# EAGLE design TwoArmedBandit_v1.1 (EAGLE 9.6.2)
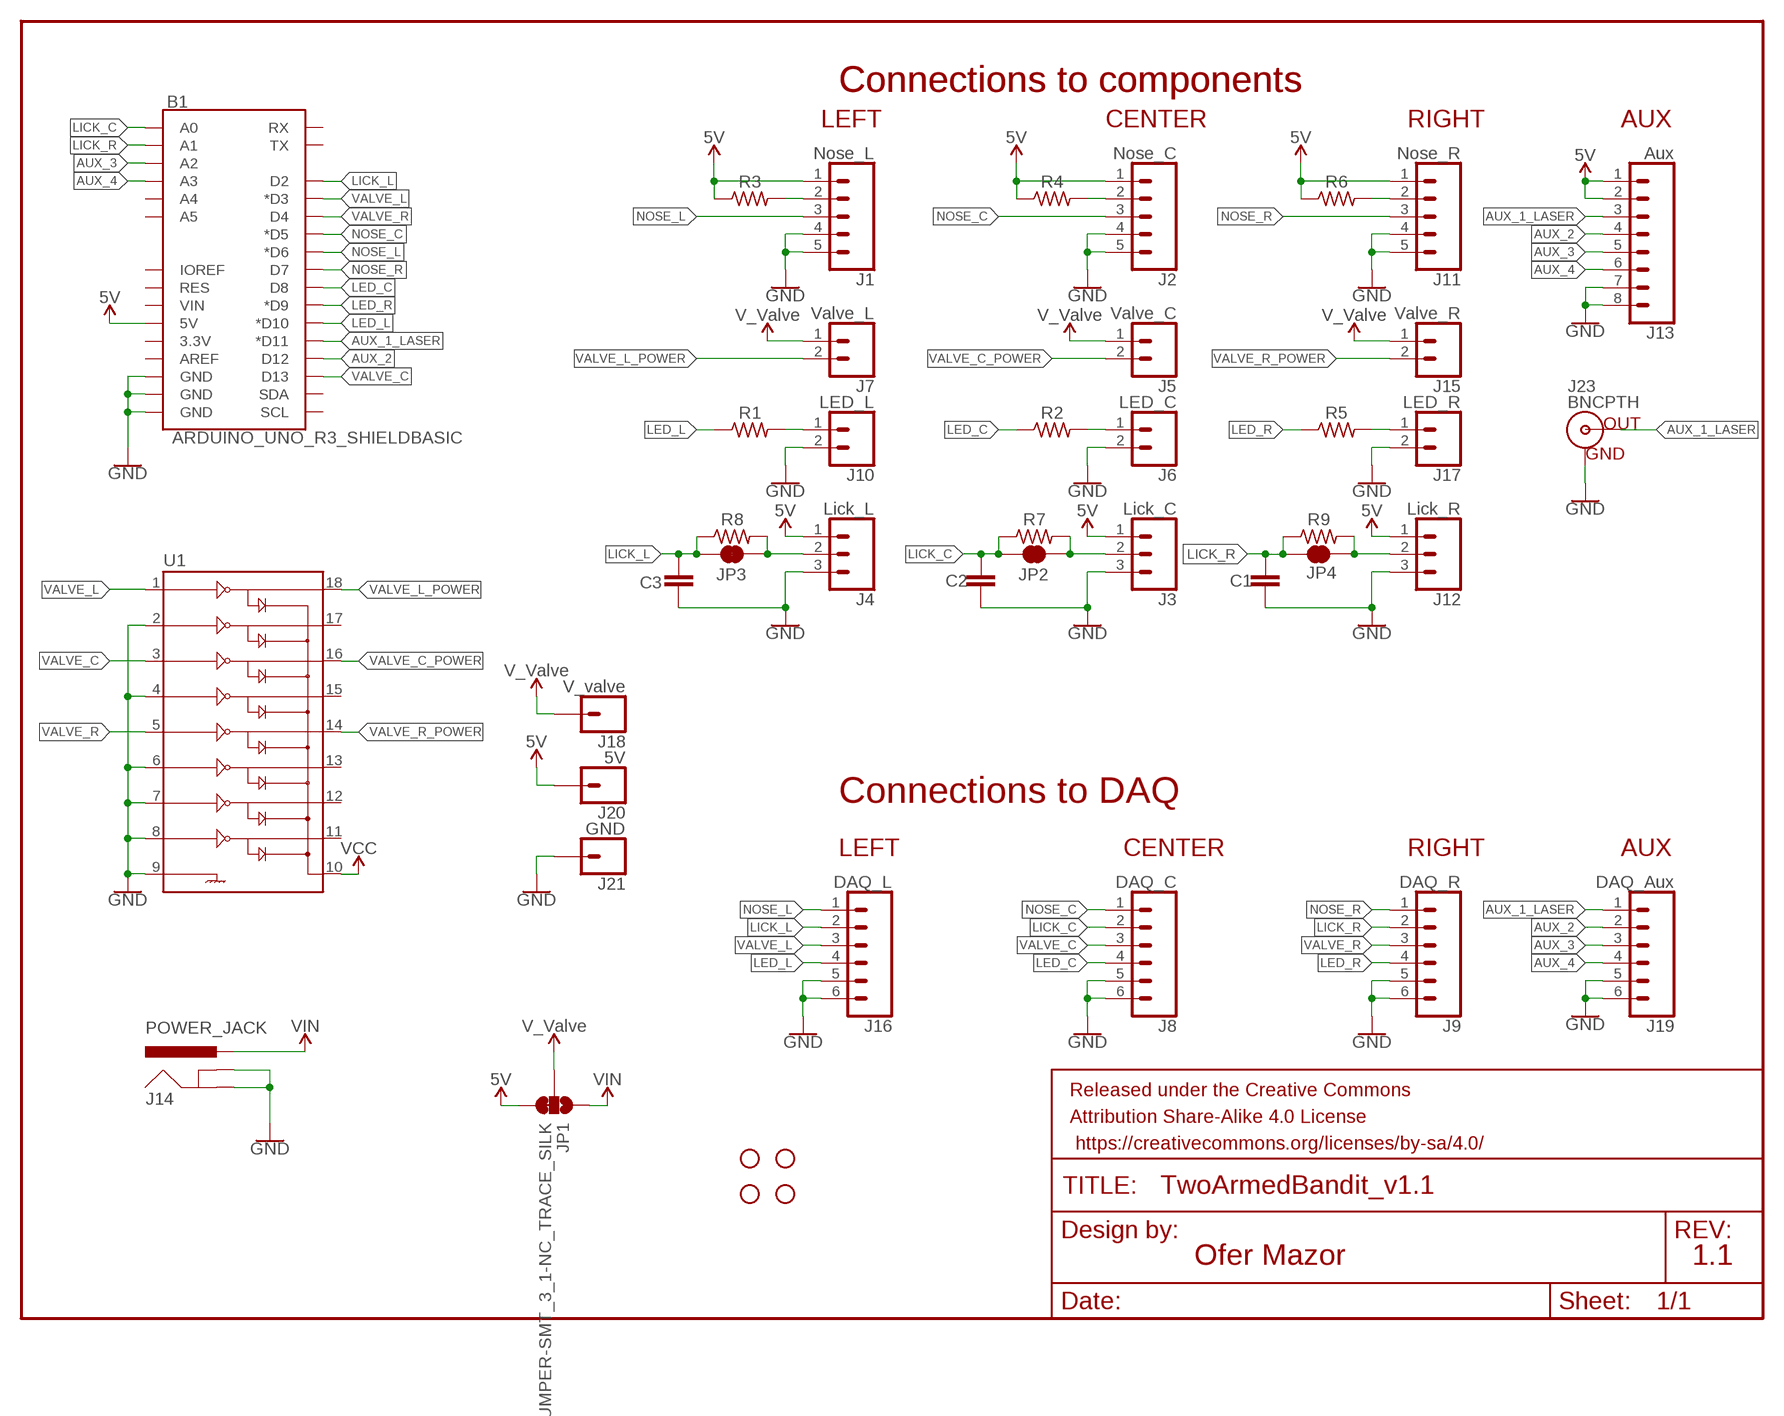
[diagram p0: schematic, sheet 1]

## Parts
B1  ARDUINO_UNO_R3_SHIELDBASIC  [UNO_R3_SHIELD]
C1  C5/2.5  [C5B2.5]
C2  C5/2.5  [C5B2.5]
C3  C5/2.5  [C5B2.5]
FRAME1  FRAME-LETTERNO_PACKAGE  [DUMMY]
H1  STAND-OFF  [STAND-OFF]
H2  STAND-OFF  [STAND-OFF]
H3  STAND-OFF  [STAND-OFF]
H4  STAND-OFF  [STAND-OFF]
J1  Nose_L  CONN_05SCREW  [SCREWTERMINAL-3.5MM-5]
J2  Nose_C  CONN_05SCREW  [SCREWTERMINAL-3.5MM-5]
J3  Lick_C  CONN_03  [1X03]
J4  Lick_L  CONN_03  [1X03]
J5  Valve_C  CONN_02  [1X02]
J6  LED_C  CONN_02  [1X02]
J7  Valve_L  CONN_02  [1X02]
J8  DAQ_C  CONN_063.5MM-6  [SCREWTERMINAL-3.5MM-6]
J9  DAQ_R  CONN_063.5MM-6  [SCREWTERMINAL-3.5MM-6]
J10  LED_L  CONN_02  [1X02]
J11  Nose_R  CONN_05SCREW  [SCREWTERMINAL-3.5MM-5]
J12  Lick_R  CONN_03  [1X03]
J13  Aux  CONN_08"  [1X08]
J14  POWER_JACK  [POWER_JACK_PTH]
J15  Valve_R  CONN_02  [1X02]
J16  DAQ_L  CONN_063.5MM-6  [SCREWTERMINAL-3.5MM-6]
J17  LED_R  CONN_02  [1X02]
J18  V_valve  CONN_01PTH_2MM  [1X01_2MM]
J19  DAQ_Aux  CONN_063.5MM-6  [SCREWTERMINAL-3.5MM-6]
J20  5V  CONN_01PTH_2MM  [1X01_2MM]
J21  GND  CONN_01PTH_2MM  [1X01_2MM]
J23  BNCPTH  [BNC]
JP1  JUMPER-SMT_3_1-NC_TRACE_SILK  [SMT-JUMPER_3_1-NC_TRACE_SILK]
JP2  JUMPER-SMT_2_NC_TRACE_NO-SILK  [SMT-JUMPER_2_NC_TRACE_NO-SILK]
JP3  JUMPER-SMT_2_NC_TRACE_NO-SILK  [SMT-JUMPER_2_NC_TRACE_NO-SILK]
JP4  JUMPER-SMT_2_NC_TRACE_NO-SILK  [SMT-JUMPER_2_NC_TRACE_NO-SILK]
R1  330  R-US_0309/12  [0309/12]
R2  330  R-US_0309/12  [0309/12]
R3  160  R-US_0309/12  [0309/12]
R4  160  R-US_0309/12  [0309/12]
R5  330  R-US_0309/12  [0309/12]
R6  160  R-US_0309/12  [0309/12]
R7  160  R-US_0309/12  [0309/12]
R8  160  R-US_0309/12  [0309/12]
R9  160  R-US_0309/12  [0309/12]
U1  ULN2803DIP  [DIL18]

## Nets
5V [power]: B1.5V J1.1 J2.1 J3.1 J4.1 J11.1 J12.1 J13.1 J13.2 J20.1 JP1.3 R3.1 R4.1 R6.1
AUX_1_LASER: B1.D11(*D11) J13.3 J19.1 J23.S(OUT)
AUX_2: B1.D12 J13.4 J19.2
AUX_3: B1.A2 J13.5 J19.3
AUX_4: B1.A3 J13.6 J19.4
GND [power]: B1.GND@0(GND) B1.GND@1(GND) B1.GND@2(GND) C1.2 C2.2 C3.2 J1.4 J1.5 J2.4 J2.5 J3.3 J4.3 J6.2 J8.5 J8.6 J9.5 J9.6 J10.2 J11.4 J11.5 J12.3 J13.7 J13.8 J14.GND J14.GNDBREAK J16.5 J16.6 J17.2 J19.5 J19.6 J21.1 J23.GND U1.2 U1.4 U1.6 U1.7 U1.8 U1.9
LED_C: B1.D8 J8.4 R2.1
LED_L: B1.D10(*D10) J16.4 R1.1
LED_R: B1.D9(*D9) J9.4 R5.1
LICK_C: B1.A0 C2.1 J8.2 JP2.1 R7.1
LICK_L: B1.D2 C3.1 J16.2 JP3.1 R8.1
LICK_R: B1.A1 C1.1 J9.2 JP4.1 R9.1
N$1: J2.2 R4.2
N$2: J1.2 R3.2
N$3: J6.1 R2.2
N$4: J11.2 R6.2
N$5: J17.1 R5.2
N$6: J12.2 JP4.2 R9.2
N$7: J3.2 JP2.2 R7.2
N$8: J4.2 JP3.2 R8.2
N$11: J10.1 R1.2
NOSE_C: B1.D5(*D5) J2.3 J8.1
NOSE_L: B1.D6(*D6) J1.3 J16.1
NOSE_R: B1.D7 J9.1 J11.3
V_VALVE [power]: J5.1 J7.1 J15.1 J18.1 JP1.2 U1.10 ; supply symbol labelled VCC, V_Valve
VALVE_C: B1.D13 J8.3 U1.3
VALVE_C_POWER [power]: J5.2 U1.16
VALVE_L: B1.D3(*D3) J16.3 U1.1
VALVE_L_POWER [power]: J7.2 U1.18
VALVE_R: B1.D4 J9.3 U1.5
VALVE_R_POWER [power]: J15.2 U1.14
VIN [power]: J14.PWR JP1.1
Unconnected: B1.3.3V B1.A4 B1.A5 B1.AREF B1.IOREF B1.RES B1.RX B1.SCL B1.SDA B1.TX B1.VIN U1.11 U1.12 U1.13 U1.15 U1.17

## Notes on the sheet
- Connections to components | Connections to components
- LEFT | CENTER | RIGHT | AUX
- Connections to DAQ
- LEFT | CENTER | RIGHT | AUX
- Ofer Mazor | 1.1

## Library data of the parts
B1 = SparkFun-Boards:ARDUINO_UNO_R3_SHIELD: Arduino R3 Shield Footprint Shield form compatible with the Arduino Uno R3. SparkFun Products: MG2639 Cellular Shield <https://www.sparkfun.com/products/13120> MIDI Shield <https://www.sparkfun.com/products/12898> R3 Stackable Headers Kit <https://www.sparkfun.com/products/11417>
C1-C3 = capacitor-wima:C: CAPACITOR naming: grid - package width
FRAME1 = SparkFun-Aesthetics:FRAME-LETTER: Schematic Frame - Letter Standard 8.5x11 US Letter frame; DESIGNER: Ofer Mazor; VERSION: v01.1
H1-H4 = SparkFun-Hardware:STAND-OFF: Stand Off Drill holes for mechanically mounting via screws, standoffs, etc. Note: Use the keepout ring to avoid running the screw head into surrounding components. Variant Overviews STAND-OFF - Mechanical footprint for a #4 phillips button head screw. STAND-OFF-TIGHT - Mechanical footprint for a #4 phillips button head screw, Example SparkFun Products Screw - Phillips Head (1/4", 4-40, 10 pack) <https://www.sparkfun.com/products/10453> (PRT-10453) Screw - Phillips Head (1/2", 4-40, 10 pack) <https://www.sparkfun.com/products/10452> (PRT-10452) Screw - Phillips Head (3/4", 4-40, 10 pack) <https://www.sparkfun.com/products/10451> (PRT-10451) Screw - Phillips Head (1", 4-40, 10 pack) <https://www.sparkfun.com/products/10450> (PRT-10450)
J1 J2 J11 = SparkFun-Connectors:CONN_05: Multi connection point. Often used as Generic Header-pin footprint for 0.1 inch spaced/style header connections On any of the 0.1 inch spaced packages, you can populate with these: Break Away Headers - Straight <https://www.sparkfun.com/products/116> (PRT-00116) Break Away Male Headers - Right Angle <https://www.sparkfun.com/products/553> (PRT-00553) Female Headers <https://www.sparkfun.com/products/115> (PRT-00115) Break Away Headers - Machine Pin <https://www.sparkfun.com/products/117> (PRT-00117) Break Away Female Headers - Swiss Machine Pin <https://www.sparkfun.com/products/743> (PRT-00743) For SCREWTERMINALS and SPRING TERMINALS visit here: Screw Terimnals on SparkFun.com <https://www.sparkfun.com/search/results?term=Screw+Terminals> (5mm/3.5mm/2.54mm spacing) This device is also useful as a general connection point to wire up your design to another part of your project. Our various solder wires solder well into these plated through hole pads. Hook-Up Wire - Assortment (Stranded, 22 AWG) <https://www.sparkfun.com/products/11375> (PRT-11375) Hook-Up Wire - Assortment (Solid Core, 22 AWG) <https://www.sparkfun.com/products/11367> (PRT-11367) View the entire wire category on our website here <https://www.sparkfun.com/categories/141> Special notes: Molex polarized connector foot print use with SKU : PRT-08231 with associated crimp pins and housings. 1MM SMD Version SKU: PRT-10208; PROD_ID: Combine 8288+8399
J3 J4 J12 = SparkFun-Connectors:CONN_03: Multi connection point. Often used as Generic Header-pin footprint for 0.1 inch spaced/style header connections On any of the 0.1 inch spaced packages, you can populate with these: Break Away Headers - Straight <https://www.sparkfun.com/products/116> (PRT-00116) Break Away Male Headers - Right Angle <https://www.sparkfun.com/products/553> (PRT-00553) Female Headers <https://www.sparkfun.com/products/115> (PRT-00115) Break Away Headers - Machine Pin <https://www.sparkfun.com/products/117> (PRT-00117) Break Away Female Headers - Swiss Machine Pin <https://www.sparkfun.com/products/743> (PRT-00743) Stackable Header - 3 Pin (Female, 0.1") <https://www.sparkfun.com/products/13875> (PRT-13875) For SCREWTERMINALS and SPRING TERMINALS visit here: Screw Terimnals on SparkFun.com <https://www.sparkfun.com/search/results?term=Screw+Terminals> (5mm/3.5mm/2.54mm spacing) This device is also useful as a general connection point to wire up your design to another part of your project. Our various solder wires solder well into these plated through hole pads. Hook-Up Wire - Assortment (Stranded, 22 AWG) <https://www.sparkfun.com/products/11375> (PRT-11375) Hook-Up Wire - Assortment (Solid Core, 22 AWG) <https://www.sparkfun.com/products/11367> (PRT-11367) View the entire wire category on our website here <https://www.sparkfun.com/categories/141> Special notes: Molex polarized connector foot print use with SKU : PRT-08232 with associated crimp pins and housings.
J5-J7 J10 J15 J17 = SparkFun-Connectors:CONN_02: Multi connection point. Often used as Generic Header-pin footprint for 0.1 inch spaced/style header connections On any of the 0.1 inch spaced packages, you can populate with these: Break Away Headers - Straight <https://www.sparkfun.com/products/116> (PRT-00116) Break Away Male Headers - Right Angle <https://www.sparkfun.com/products/553> (PRT-00553) Female Headers <https://www.sparkfun.com/products/115> (PRT-00115) Break Away Headers - Machine Pin <https://www.sparkfun.com/products/117> (PRT-00117) Break Away Female Headers - Swiss Machine Pin <https://www.sparkfun.com/products/743> (PRT-00743) For SCREWTERMINALS and SPRING TERMINALS visit here: Screw Terimnals on SparkFun.com <https://www.sparkfun.com/search/results?term=Screw+Terminals> (5mm/3.5mm/2.54mm spacing) This device is also useful as a general connection point to wire up your design to another part of your project. Our various solder wires solder well into these plated through hole pads. Hook-Up Wire - Assortment (Stranded, 22 AWG) <https://www.sparkfun.com/products/11375> (PRT-11375) Hook-Up Wire - Assortment (Solid Core, 22 AWG) <https://www.sparkfun.com/products/11367> (PRT-11367) View the entire wire category on our website here <https://www.sparkfun.com/categories/141> Special notes: Molex polarized connector foot print use with: PRT-08233 with associated crimp pins and housings. 2.54_SCREWTERM for use with PRT-10571. 3.5mm Screw Terminal footprints for PRT-08084 5mm Screw Terminal footprints for use with PRT-08432
J8 J9 J16 J19 = SparkFun-Connectors:CONN_06: Multi connection point. Often used as Generic Header-pin footprint for 0.1 inch spaced/style header connections On any of the 0.1 inch spaced packages, you can populate with these: Break Away Headers - Straight <https://www.sparkfun.com/products/116> (PRT-00116) Break Away Male Headers - Right Angle <https://www.sparkfun.com/products/553> (PRT-00553) Female Headers <https://www.sparkfun.com/products/115> (PRT-00115) Break Away Headers - Machine Pin <https://www.sparkfun.com/products/117> (PRT-00117) Break Away Female Headers - Swiss Machine Pin <https://www.sparkfun.com/products/743> (PRT-00743) Arduino Stackable Header - 6 Pin <https://www.sparkfun.com/products/9280> (PRT-09280) For SCREWTERMINALS and SPRING TERMINALS visit here: Screw Terimnals on SparkFun.com <https://www.sparkfun.com/search/results?term=Screw+Terminals> (5mm/3.5mm/2.54mm spacing) This device is also useful as a general connection point to wire up your design to another part of your project. Our various solder wires solder well into these plated through hole pads. Hook-Up Wire - Assortment (Stranded, 22 AWG) <https://www.sparkfun.com/products/11375> (PRT-11375) Hook-Up Wire - Assortment (Solid Core, 22 AWG) <https://www.sparkfun.com/products/11367> (PRT-11367) View the entire wire category on our website here <https://www.sparkfun.com/categories/141>
J13 = SparkFun-Connectors:CONN_08: Multi connection point. Often used as Generic Header-pin footprint for 0.1 inch spaced/style header connections On any of the 0.1 inch spaced packages, you can populate with these: Break Away Headers - Straight <https://www.sparkfun.com/products/116> (PRT-00116) Break Away Male Headers - Right Angle <https://www.sparkfun.com/products/553> (PRT-00553) Female Headers <https://www.sparkfun.com/products/115> (PRT-00115) Break Away Headers - Machine Pin <https://www.sparkfun.com/products/117> (PRT-00117) Break Away Female Headers - Swiss Machine Pin <https://www.sparkfun.com/products/743> (PRT-00743) Arduino Stackable Header - 8 Pin <https://www.sparkfun.com/products/9279> (PRT-09279) For SCREWTERMINALS and SPRING TERMINALS visit here: Screw Terimnals on SparkFun.com <https://www.sparkfun.com/search/results?term=Screw+Terminals> (5mm/3.5mm/2.54mm spacing) This device is also useful as a general connection point to wire up your design to another part of your project. Our various solder wires solder well into these plated through hole pads. Hook-Up Wire - Assortment (Stranded, 22 AWG) <https://www.sparkfun.com/products/11375> (PRT-11375) Hook-Up Wire - Assortment (Solid Core, 22 AWG) <https://www.sparkfun.com/products/11367> (PRT-11367) View the entire wire category on our website here <https://www.sparkfun.com/categories/141> Special notes: Molex polarized connector foot print use with SKU : PRT-08231 with associated crimp pins and housings. 1MM SMD Version SKU: PRT-10208 NOTES ON THE VARIANTS LOCK and LOCK_LONGPADS... This footprint was designed to help hold the alignment of a through-hole component (i.e. 6-pin header) while soldering it into place. You may notice that each hole has been shifted either up or down by 0.005 of an inch from it's more standard position (which is a perfectly straight line). This slight alteration caused the pins (the squares in the middle) to touch the edges of the holes. Because they are alternating, it causes a "brace" to hold the component in place. 0.005 has proven to be the perfect amount of "off-center" position when using our standard breakaway headers. Although looks a little odd when you look at the bare footprint, once you have a header in there, the alteration is very hard to notice. Also,if you push a header all the way into place, it is covered up entirely on the bottom side.; PROD_ID: CONN-08438
J14 = SparkFun-Connectors:POWER_JACK: Power Jack Connector This is the standard 5.5mm barrel jack for power. The PTH is the most common, proven, reliable, footprint. The Slot footprint only works if the mill layer is transmitted to the PCB fab house so be warned. Here are the connectors we sell at SparkFun: DC Barrel Power Jack/Connector <https://www.sparkfun.com/products/119> (PRT-00119) DC Barrel Power Jack/Connector (SMD) <https://www.sparkfun.com/products/12748> (PRT-12748) DC Barrel Jack Adapter - Breadboard Compatible <https://www.sparkfun.com/products/10811> (PRT-10811) It is used on this SparkFun product (and many, many others): SparkFun RedBoard - Programmed with Arduino <https://www.sparkfun.com/products/12757> (DEV-12757) Also, if you need a mating power supply or connector, please check these out: Wall Adapter Power Supply - 9VDC 650mA <https://www.sparkfun.com/products/298> (TOL-00298) DC Barrel Jack Adapter - Male <https://www.sparkfun.com/products/10287> (PRT-10287); PROD_ID: CONN-08197
J18 J20 J21 = SparkFun-Connectors:CONN_01: Single connection point. Often used as Generic Header-pin footprint for 0.1 inch spaced/style header connections On any of the 0.1 inch spaced packages, you can populate with these: Break Away Headers - Straight <https://www.sparkfun.com/products/116> (PRT-00116) Break Away Male Headers - Right Angle <https://www.sparkfun.com/products/553> (PRT-00553) Female Headers <https://www.sparkfun.com/products/115> (PRT-00115) Break Away Headers - Machine Pin <https://www.sparkfun.com/products/117> (PRT-00117) Break Away Female Headers - Swiss Machine Pin <https://www.sparkfun.com/products/743> (PRT-00743) This device is also useful as a general connection point to wire up your design to another part of your project. Our various solder wires solder well into these plated through hole pads. Hook-Up Wire - Assortment (Stranded, 22 AWG) <https://www.sparkfun.com/products/11375> (PRT-11375) Hook-Up Wire - Assortment (Solid Core, 22 AWG) <https://www.sparkfun.com/products/11367> (PRT-11367) View the entire wire category on our website here <https://www.sparkfun.com/categories/141> Special notes: SMTSO-256-ET is a "flush mount" nut for a 4-40 screw. We mostly use this on specialty testbeds; it is a nice way to connect hardware to your PCB at an adjustable hieght. Also note, the SNAP packages are for using a snappable style connector. We sell a baggie of snaps and they are also used on two LilyPad designs: Snap Assortment - 30 pack (male and female) <https://www.sparkfun.com/products/11347> (DEV-11347) LilyPad Arduino SimpleSnap <https://www.sparkfun.com/products/10941> (DEV-10941) LilyPad SimpleSnap Protoboard <https://www.sparkfun.com/products/10940> (DEV-10940)
J23 = SparkFun-Connectors:BNC: BNC Right Angle Connector Mouser Part# 5227161 SparkFun Products: BNC Connector - Right Angle <https://www.sparkfun.com/products/10550>; PROD_ID: LPA-12729; SF_ID: PRT-10550
JP1 = SparkFun-Jumpers:JUMPER-SMT_3_1-NC_TRACE: Normally closed trace jumper (1 of 2 connections) This jumper has a trace between two pads so it's normally closed (NC). The other connection is normally open (NO). Use a razor knife to open the connection. For best results follow the IPC guidelines for cutting traces: Cutout at least 0.063 mm (0.005 in). Remove all loose material to clean up the cut area. Seal the cut with an approved epoxy. Reapply solder to reclose the connection, or to close the NO connection.
JP2-JP4 = SparkFun-Jumpers:JUMPER-SMT_2_NC_TRACE: Normally closed trace jumper This jumper has a trace between two pads so it's normally closed (NC). Use a razor knife to open the connection. For best results follow the IPC guidelines for cutting traces: Cutout at least 0.063 mm (0.005 in). Remove all loose material to clean up the cut area. Seal the cut with an approved epoxy. Reapply solder to reclose the connection.
R1-R9 = rcl:R-US_: RESISTOR, American symbol; SPICEPREFIX: R
U1 = SparkFun-IC-Special-Function:ULN2803: Darlington Driver(IC-07959, low stock) ULN2803 Darlington array. 500mA max per channel, 8-channel package. Spark Fun Electronics SKU : COM-00312

## Net classes
0 default: width 0.305 mm
1 power: width 0.61 mm

## Board
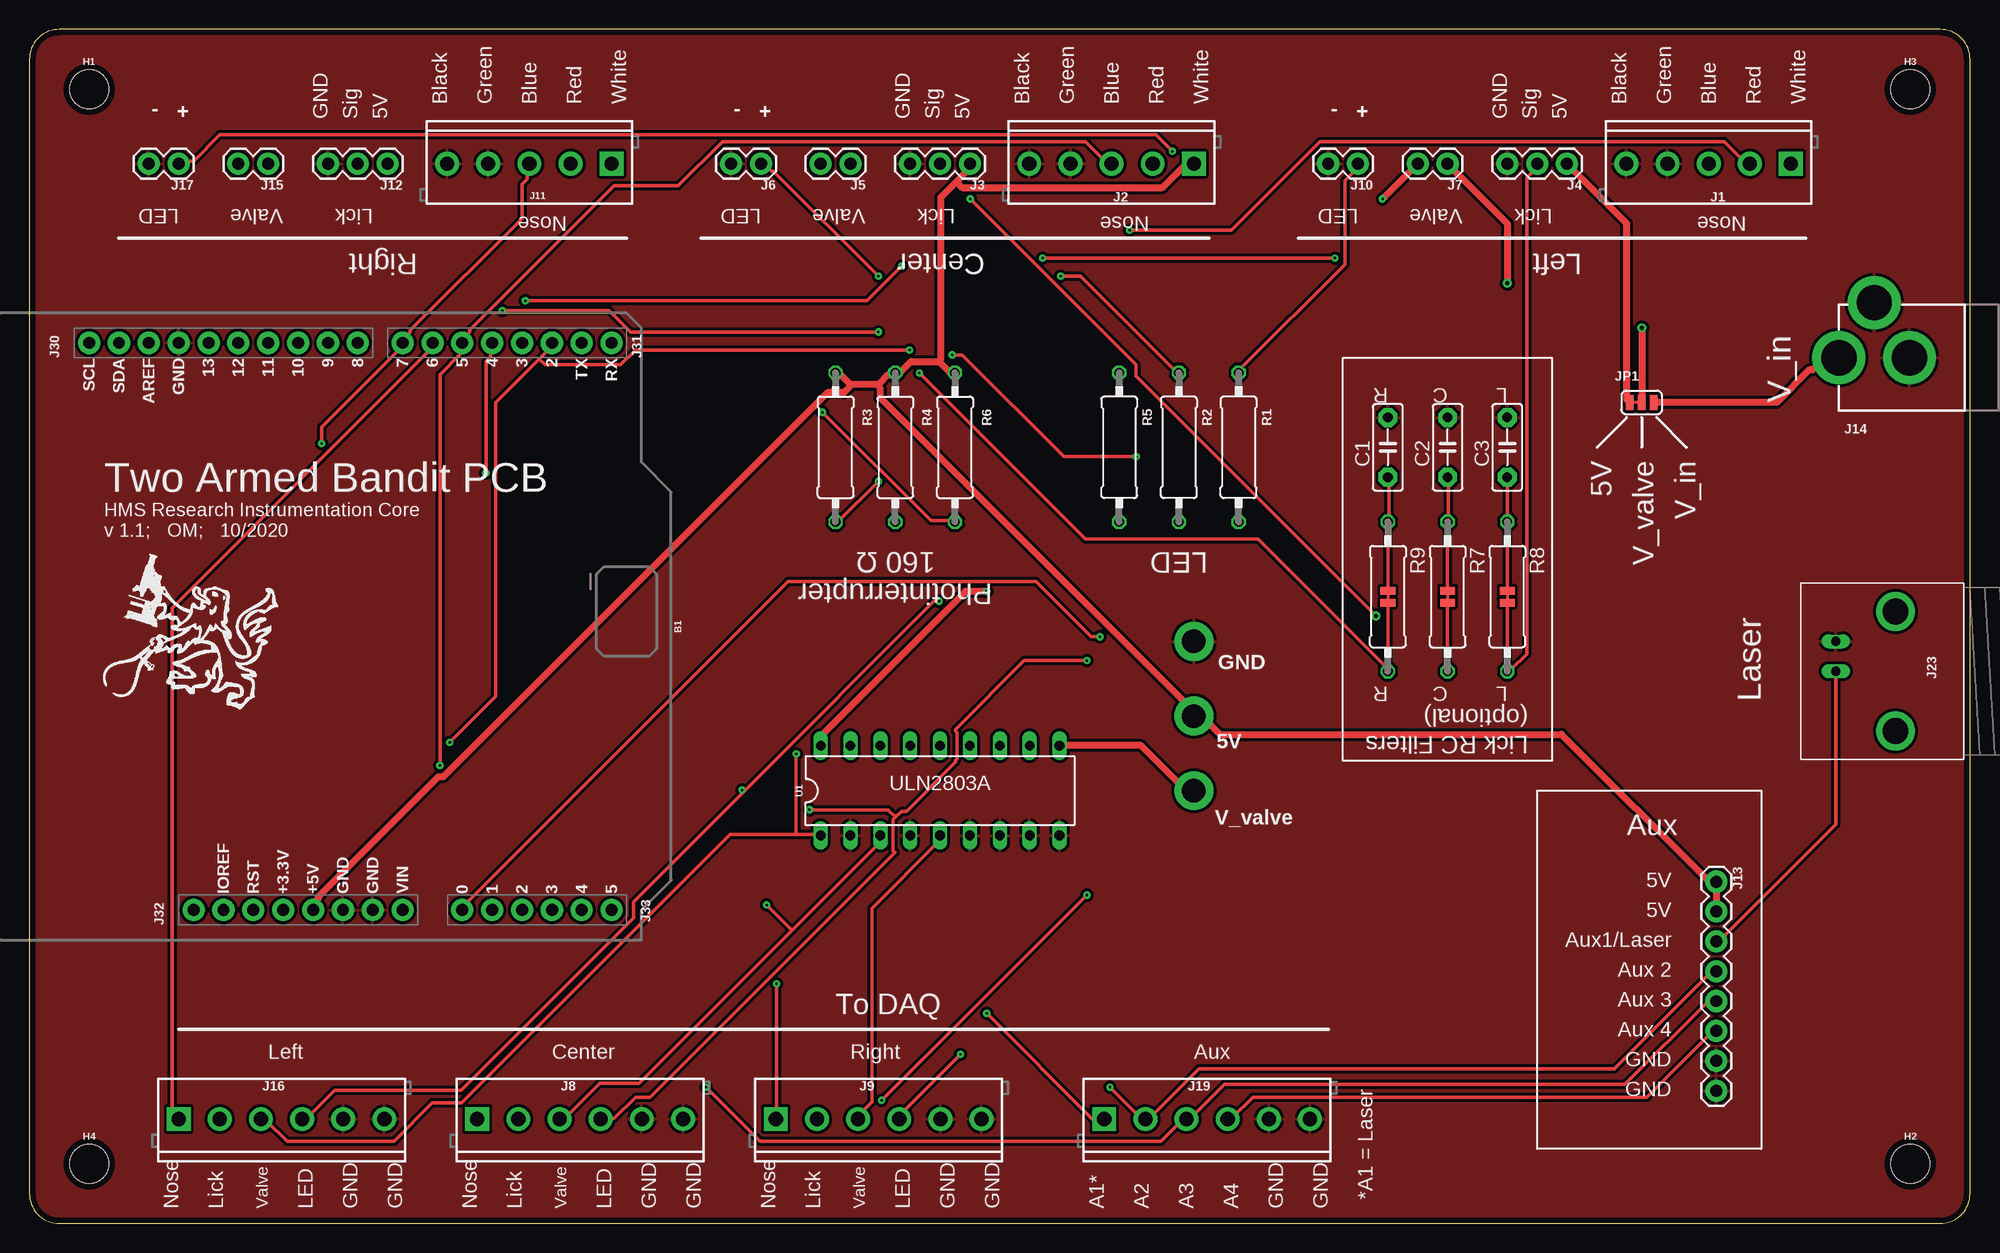
[diagram p1: board, top side]
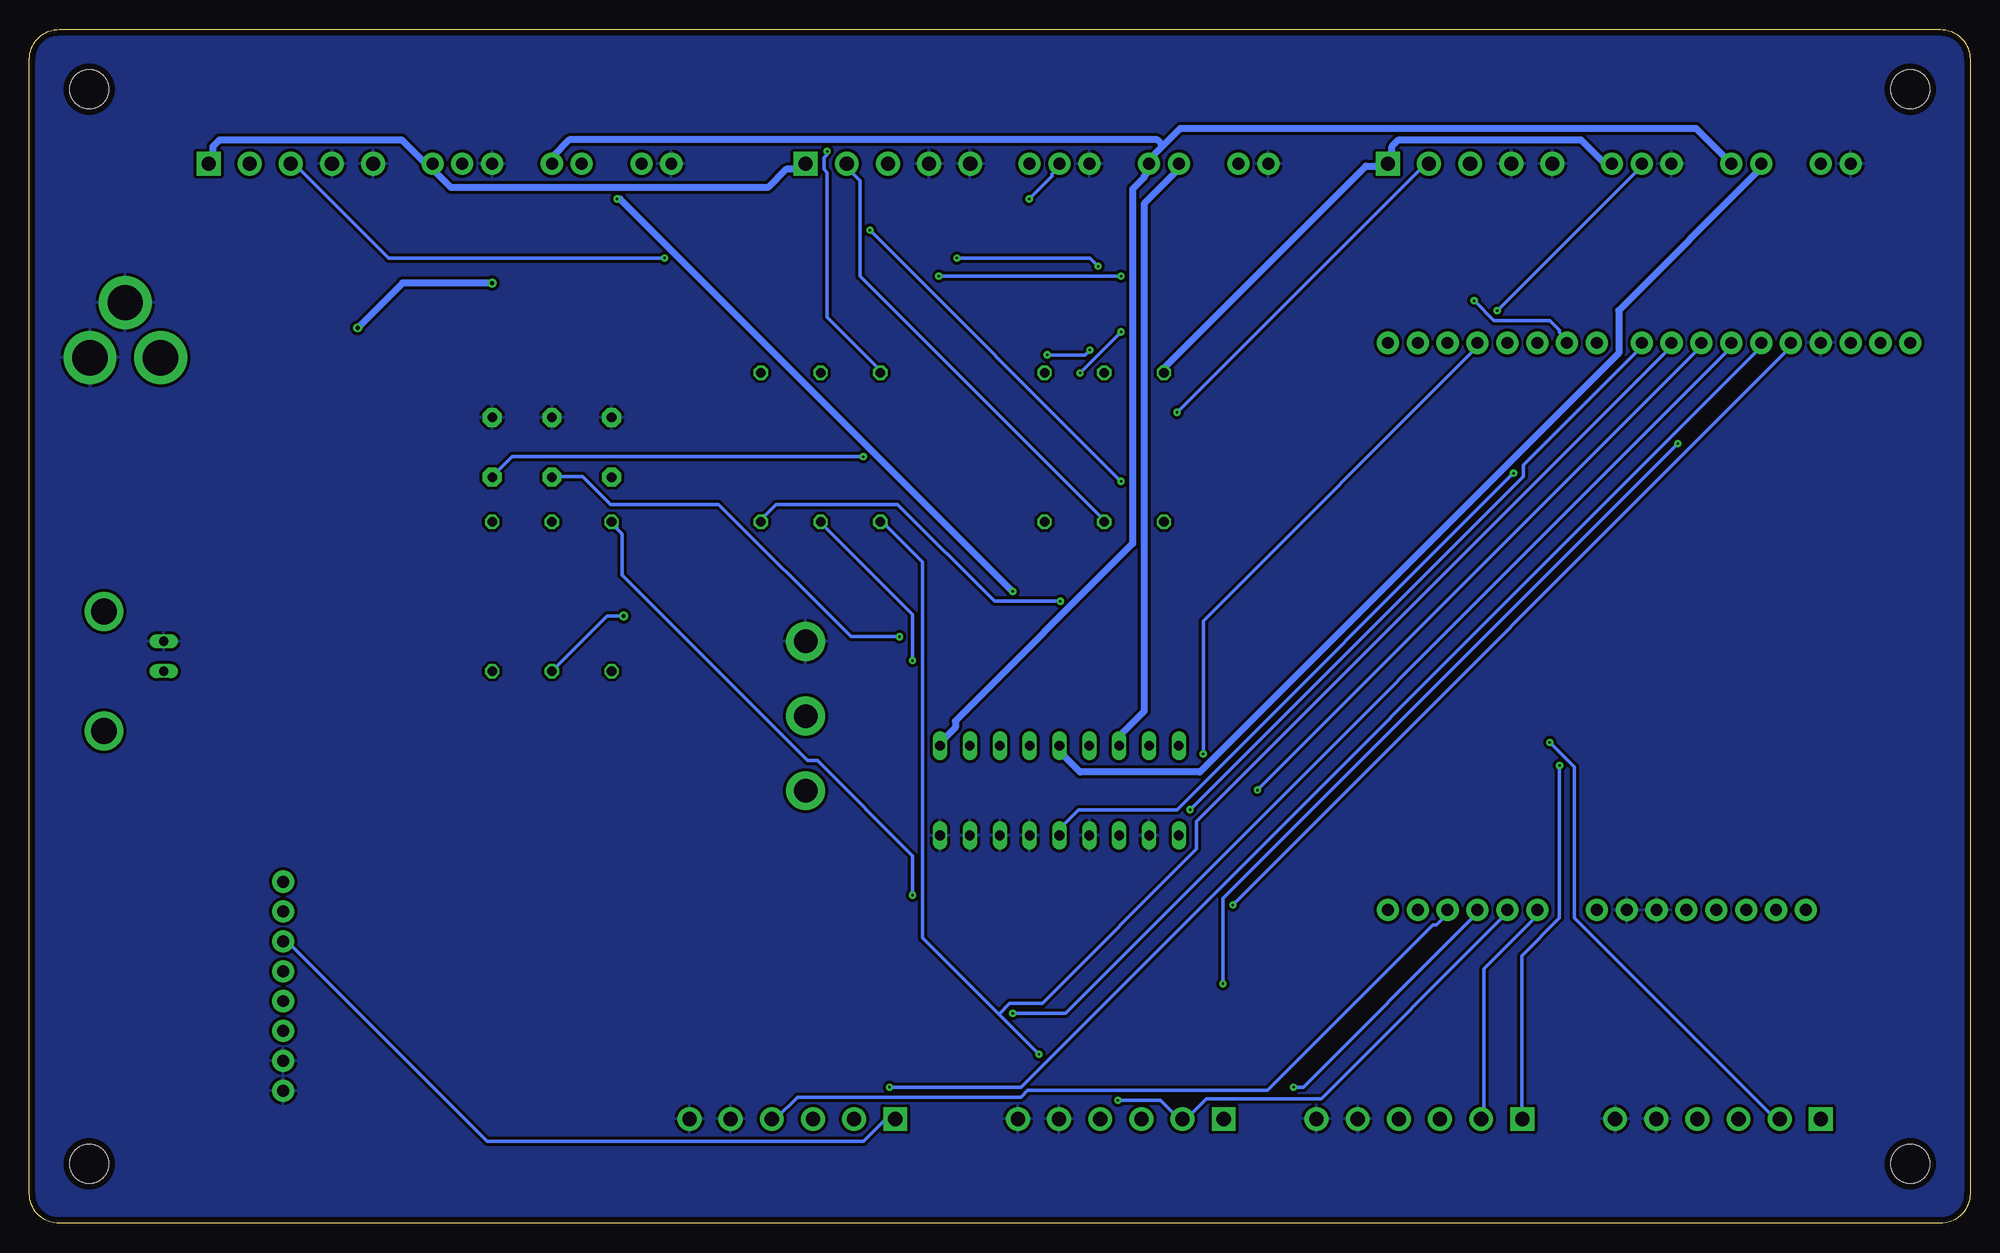
[diagram p2: board, bottom side, seen from below]

Size 165.1 x 101.6 mm. Coordinates in mm from the lower left corner, seen from the top.
Outline: 0,99.06 0,2.54 arc90 2.54,0 162.56,0 arc90 165.1,2.54 165.1,99.06 arc90 162.56,101.6 2.54,101.6 arc90 0,99.06
Copper layers (1*16): Top 0.0178mm / dielectric 59mil / Bottom 0.0178mm
Design rules "SSC-EAGLE-2Lyr_v1.0.0.3 *": minimum track width 6mil, minimum drill 8mil, track to track 10mil, track to pad 10mil, pad to pad 10mil, via to via 10mil, smd to smd 6mil, copper to edge 20mil, drill to drill 16mil, minimum pad ring 8mil, minimum via ring 8mil, stop-mask expansion 3mil, vias tented up to drill 0mil, thermal gap 10mil

### Footprints (pad centres in the part's own frame; a part is rotated, then mirrored left to right if it is on the bottom)
UNO_R3_SHIELD = drill 1.016 pad 1.88: 3.3V 24.13,-2.54; 5V 24.13,0; A0 24.13,12.7; A1 24.13,15.24; A2 24.13,17.78; A3 24.13,20.32; A4 24.13,22.86; A5 24.13,25.4; AREF -24.13,-13.97; D2 -24.13,20.32; D3 -24.13,17.78; D4 -24.13,15.24; D5 -24.13,12.7; D6 -24.13,10.16; D7 -24.13,7.62; D8 -24.13,3.81; D9 -24.13,1.27; D10 -24.13,-1.27; D11 -24.13,-3.81; D12 -24.13,-6.35; D13 -24.13,-8.89; GND@0 24.13,2.54; GND@1 24.13,5.08; GND@2 -24.13,-11.43; IOREF 24.13,-7.62; NC 24.13,-10.16; RES 24.13,-5.08; RX -24.13,25.4; SCL -24.13,-19.05; SDA -24.13,-16.51; TX -24.13,22.86; VIN 24.13,7.62
C5B2.5 = drill 0.813 pad 1.6 octagon: 1 -2.54,0; 2 2.54,0
STAND-OFF = hole 3.302: 0,0
SCREWTERMINAL-3.5MM-5 = drill 1.2 pad 2.032 square: 1 0,0 | drill 1.2 pad 2.032: 2 3.5,0; 3 7,0; 4 10.5,0; 5 14,0
1X03 = drill 1.016 pad 1.88: 1 0,0; 2 2.54,0; 3 5.08,0
1X02 = drill 1.016 pad 1.88: 1 0,0; 2 2.54,0
SCREWTERMINAL-3.5MM-6 = drill 1.2 pad 2.032 square: 1 0,0 | drill 1.2 pad 2.032: 2 3.5,0; 3 7,0; 4 10.5,0; 5 14,0; 6 17.5,0
1X08 = drill 1.016 pad 1.88: 1 0,0; 2 2.54,0; 3 5.08,0; 4 7.62,0; 5 10.16,0; 6 12.7,0; 7 15.24,0; 8 17.78,0
POWER_JACK_PTH = drill 2.997 pad 4.318: GND 0,7.7; GNDBREAK 4.7,10.7; PWR 0,13.7
1X01_2MM = drill 2 pad 3.302: 1 0,0
BNC = drill 2.2: 3 -5.08,5.08; 4 5.08,5.08 | drill 0.8 long: GND -2.54,0; S 0,0
SMT-JUMPER_3_1-NC_TRACE_SILK = smd 0.635 x 1.27: 1 -1.016,0; 2 0,0; 3 1.016,0
SMT-JUMPER_2_NC_TRACE_NO-SILK = smd 0.635 x 1.27: 1 -0.508,0; 2 0.508,0
0309/12 = drill 0.813 octagon: 1 -6.35,0; 2 6.35,0
DIL18 = drill 0.813 long: 1 -10.16,-3.81; 2 -7.62,-3.81; 3 -5.08,-3.81; 4 -2.54,-3.81; 5 0,-3.81; 6 2.54,-3.81; 7 5.08,-3.81; 8 7.62,-3.81; 9 10.16,-3.81; 10 10.16,3.81; 11 7.62,3.81; 12 5.08,3.81; 13 2.54,3.81; 14 0,3.81; 15 -2.54,3.81; 16 -5.08,3.81; 17 -7.62,3.81; 18 -10.16,3.81

### Placement (x,y rotation side)
B1  24.13,50.8 270 top
C1  115.57,66.04 90 top
C2  120.65,66.04 90 top
C3  125.73,66.04 90 top
FRAME1  -5.08,-2.54 180 top  (outside the outline)
H1  5.08,96.52 0 top
H2  160.02,5.08 0 top
H3  160.02,96.52 0 top
H4  5.08,5.08 0 top
J1  149.86,90.17 180 top
J2  99.06,90.17 180 top
J3  80.01,90.17 180 top
J4  130.81,90.17 180 top
J5  69.85,90.17 180 top
J6  62.23,90.17 180 top
J7  120.65,90.17 180 top
J8  38.1,8.89 0 top
J9  63.5,8.89 0 top
J10  113.03,90.17 180 top
J11  49.53,90.17 180 top
J12  30.48,90.17 180 top
J13  143.51,29.08 270 top
J14  167.64,73.66 90 top
J15  20.32,90.17 180 top
J16  12.7,8.89 0 top
J17  12.7,90.17 180 top
J18  99.06,36.83 0 top
J19  91.44,8.89 0 top
J20  99.06,43.18 0 top
J21  99.06,49.53 0 top
J23  153.67,46.99 270 top
JP1  137.16,69.85 180 top
JP2  120.65,53.34 270 top
JP3  125.73,53.34 270 top
JP4  115.57,53.34 270 top
R1  102.87,66.04 90 top
R2  97.79,66.04 90 top
R3  68.58,66.04 270 top
R4  73.66,66.04 270 top
R5  92.71,66.04 90 top
R6  78.74,66.04 270 top
R7  120.65,53.34 270 top
R8  125.73,53.34 270 top
R9  115.57,53.34 270 top
U1  77.47,36.83 0 top
U$1  [RIC_LOGO_BIG]  13.97,49.53 0 top

### Tracks (layer width: path | path; a pad name or v marks a point on that pad's centre or on a via)
5V
  Top 0.61: J13.2 J13.1 143.19,29.06 142.91,29.06 130.34,41.63 101.28,41.63 99.75,43.17 99.19,43.17 J20.1 98.91,43.45 98.91,43.73 72.36,70.27 72.36,71.11 72.22,71.39 | 69.85,71.39 68.87,72.36 68.59,72.36 R3.1 | 72.22,71.39 69.85,71.39 | 72.22,71.39 73.06,72.22 73.2,72.22 73.34,72.36 73.62,72.36 R4.1 73.9,72.22 75.02,73.34 77.39,73.34 | 77.39,73.34 78.37,72.36 78.65,72.36 R6.1 | B1.5V 24.17,26.68 24.17,27.24 24.59,27.66 24.59,27.8 34.78,38 35.2,38 67.89,70.69 69.29,70.69 69.71,71.11 69.85,71.39 | 78.86,88.64 77.53,87.31 77.53,73.62 77.39,73.34 | 78.86,88.64 79.91,89.69 79.91,90.11 J3.1 | 78.86,88.64 79.35,88.15 96.39,88.15 98.35,90.11 99.05,90.11 J2.1 | J4.1 135.89,85.09 135.89,70.1 JP1.3
  Bottom 0.61: J1.1 149.76,90.25 149.48,90.53 149.48,91.64 148.92,92.2 133.41,92.2 131.46,90.25 130.9,90.25 J4.1 130.62,89.97 130.62,89.55 129.22,88.15 102.26,88.15 100.72,89.69 99.61,89.69 99.19,90.11 J2.1 | J12.1 30.59,90.25 31.15,90.25 33.11,92.2 48.62,92.2 49.17,91.64 49.17,90.53 J11.1 49.73,89.97 51.41,89.97 68.59,72.78 68.59,72.5 R3.1
AUX_1_LASER  (via drill 0.2)
  Top 0.305: J23.S 153.67,33.95 143.61,23.89 J13.3 | v81.44,17.88 90.53,8.8 91.36,8.8 J19.1
  Bottom 0.305: v81.44,17.88 76.97,17.88 20.4,74.46 20.4,74.88 B1.D11 | J13.3 143.47,23.89 143.05,23.89 126.15,6.99 94.16,6.99 92.34,8.8 91.5,8.8 J19.1
AUX_2  (via drill 0.2)
  Top 0.305: v91.92,11.6 94.58,8.94 94.86,8.94 J19.2 95,8.94 95.28,8.94 99.48,13.14 134.82,13.14 143.05,21.37 143.47,21.37 J13.4
  Bottom 0.305: v91.92,11.6 80.75,11.6 17.88,74.46 17.88,74.88 B1.D12
AUX_3  (via drill 0.2)
  Top 0.305: v57.56,11.6 62.17,6.99 96.25,6.99 98.07,8.8 98.35,8.8 J19.3 98.49,8.94 98.77,8.94 101.65,11.82 135.74,11.82 142.77,18.86 143.47,18.86 J13.5
  Bottom 0.305: v57.56,11.6 56.72,11.6 42.33,25.98 42.33,26.12 41.91,26.54 B1.A2
AUX_4
  Top 0.305: J13.6 143.47,16.34 143.19,16.34 137.6,10.76 104.08,10.76 102.26,8.94 101.98,8.94 J19.4
  Bottom 0.305: B1.A3 44.56,26.54 44.56,26.26 45.4,25.43 45.68,25.43 59.79,11.32 80.19,11.32 80.75,10.76 99.75,10.76 101.56,8.94 101.84,8.94 J19.4
GND
  pour Top: 2.54,0 162.56,0 arc90 165.1,2.54 165.1,99.06 arc90 162.56,101.6 2.54,101.6 arc90 0,99.06 0,2.54 arc90
  pour Bottom: 2.54,0 162.56,0 arc90 165.1,2.54 165.1,99.06 arc90 162.56,101.6 2.54,101.6 arc90 0,99.06 0,2.54 arc90
LED_C  (via drill 0.2)
  Top 0.305: v89.97,47.89 84.63,47.89 78.79,42.05 78.79,41.91 78.93,41.77 78.93,39.53 78.79,39.4 78.79,39.26 74.6,35.06 74.18,35.06 73.69,34.58 | 73.69,34.58 73.48,34.37 73.48,31.71 73.62,31.57 52.81,10.76 51.55,10.76 49.73,8.94 48.62,8.94 J8.4 | v66.36,35.2 73.06,35.2 73.69,34.58
  Bottom 0.305: v89.97,47.89 89.97,51.83 97.79,59.65 R2.1 | B1.D8 27.94,74.6 38,64.54 38,63.56 v66.36,35.2
LED_L  (via drill 0.2)
  Top 0.305: v77.39,52.95 76.97,52.95 60.84,36.81 | 60.84,36.81 51.41,27.38 51.41,25.98 36.74,11.32 25.98,11.32 23.61,8.94 23.33,8.94 J16.4 | v60.63,36.88 60.77,36.88 60.84,36.81
  Bottom 0.305: v77.39,52.95 83,52.95 91.24,61.19 101.56,61.19 102.82,59.93 102.82,59.79 R1.1 | v60.63,36.88 22.91,74.6 22.91,74.88 B1.D10
LED_R  (via drill 0.2)
  Top 0.305: v79.21,14.39 74.04,9.22 74.04,8.94 J9.4
  Bottom 0.305: v79.21,14.39 82.63,17.81 | 82.63,17.81 89.13,24.31 89.13,56.3 92.48,59.65 92.62,59.65 R5.1 | 82.63,17.81 81.72,18.72 78.93,18.72 65.8,31.85 65.8,34.23 25.43,74.6 25.43,74.88 B1.D9
LICK_C  (via drill 0.2)
  Top 0.305: C2.1 120.7,63.42 120.7,59.79 R7.1 JP2.1 | v91.07,49.92 90.31,49.92 90.32,49.93 85.62,54.62 64.54,54.62 36.88,26.96 36.88,26.68 B1.A0
  Bottom 0.305: B1.A0 36.88,26.54 36.88,26.12 41.35,21.65 41.35,9.92 41.49,9.78 41.49,8.94 J8.2 | v91.07,49.92 95.19,49.92 106.45,61.19 115.67,61.19 118.05,63.56 120.56,63.56 C2.1
LICK_L  (via drill 0.2)
  Top 0.305: C3.1 R8.1 JP3.1 | 43.38,73.55 39.67,69.85 39.67,44.84 v35.76,40.93 | 43.38,73.55 44.42,74.6 44.42,74.88 B1.D2 | v94.16,65.24 88.01,65.24 79.35,73.9 v78.51,73.9 | v74.88,74.32 51.55,74.32 50.29,73.06 43.87,73.06 43.38,73.55
  Bottom 0.305: v35.76,40.93 33.67,38.84 33.67,25.98 16.62,8.94 16.2,8.94 J16.2 | v94.16,65.24 124.05,65.24 125.73,63.56 C3.1 | v78.51,73.9 75.3,73.9 v74.88,74.32
LICK_R  (via drill 0.2)
  Top 0.305: C1.1 115.67,63.42 115.67,59.79 R9.1 JP4.1 | v72.5,10.48 v89.97,27.94
  Bottom 0.305: B1.A1 39.4,26.54 39.81,26.12 39.81,25.98 55.17,10.63 64.95,10.63 66.64,8.94 66.92,8.94 J9.2 67.06,8.94 67.33,8.94 68.87,10.48 v72.5,10.48 | R9.1 115.11,59.23 115.11,59.09 114.69,58.67 114.69,55.18 98.91,39.4 98.07,39.4 89.97,31.29 v89.97,27.94
N$1
  Bottom 0.305: R4.2 73.76,59.79 73.76,59.93 94.44,80.61 94.44,88.71 95.56,89.83 95.56,90.11 J2.2
N$2  (via drill 0.2)
  Top 0.305: v72.22,63.14 68.87,59.79 68.59,59.79 R3.2 | v93.6,84.52 102.26,84.52 109.8,92.06 144.17,92.06 145.99,90.25 146.27,90.25 J1.2
  Bottom 0.305: v93.6,84.52 v72.22,63.14
N$3  (via drill 0.2)
  Top 0.305: v87.73,80.61 89.41,80.61 97.51,72.5 97.79,72.5 R2.2 | v72.22,80.61 63.28,89.55 63.14,89.55 62.59,90.11 62.31,90.11 J6.1
  Bottom 0.305: v72.22,80.61 v87.73,80.61
N$4  (via drill 0.2)
  Top 0.305: v67.47,69.01 76.69,59.79 78.65,59.79 R6.2
  Bottom 0.305: v67.47,69.01 46.38,90.11 46.1,90.11 J11.2
N$5  (via drill 0.2)
  Top 0.305: v97.23,91.22 95.83,92.62 16.2,92.62 13.97,90.39 12.85,90.39 12.71,90.25 J17.1
  Bottom 0.305: v97.23,91.22 97.23,90.94 97.51,90.67 97.51,89.69 97.23,89.41 97.23,77.11 92.76,72.64 92.76,72.5 R5.2
N$6  (via drill 0.2)
  Top 0.305: v75.72,72.36 89.83,58.26 104.5,58.26 115.53,47.22 115.53,47.08 R9.2 JP4.2 | v72.22,75.86 51.13,75.86 49.31,77.67 v40.23,77.67
  Bottom 0.305: v72.22,75.86 v75.72,72.36 | v40.23,77.67 27.94,89.97 J12.2
N$7  (via drill 0.2, 0.35)
  Top 0.305: v80.05,87.17 94.16,73.06 94.16,72.08 v114.55,51.69 | R7.2 JP2.2
  Bottom 0.305: v80.05,87.17 78.09,89.13 78.09,89.27 77.53,89.83 77.53,90.11 J3.2 | v114.55,51.69 115.95,51.69 R7.2
N$8
  Top 0.305: J4.2 128.25,90.11 128.25,89.83 127.41,88.99 127.41,48.48 126.01,47.08 125.73,47.08 R8.2 JP3.2
N$11
  Top 0.305: R1.2 102.96,72.5 102.96,72.64 111.9,81.58 111.9,88.71 113.02,89.83 113.02,90.11 J10.1
NOSE_C  (via drill 0.2)
  Top 0.305: J2.3 91.92,90.25 91.64,90.25 89.83,92.06 58.95,92.06 55.18,88.29 49.73,88.29 37.44,76 37.44,75.86 36.88,75.3 36.88,75.02 B1.D5 36.74,74.88 36.74,74.04 34.92,72.22 v34.92,38.98
  Bottom 0.305: v34.92,38.98 34.92,25.98 38.14,22.77 38.14,8.94 J8.1
NOSE_L  (via drill 0.2)
  Top 0.305: B1.D6 34.23,74.88 34.23,74.46 12.15,52.39 12.15,9.36 12.57,8.94 J16.1 | v86.19,82.14 v111.06,82.14 | v74.18,81.44 71.25,78.51 v42.19,78.51
  Bottom 0.305: v111.06,82.14 134.53,82.14 142.49,90.11 142.77,90.11 J1.3 | v86.19,82.14 74.88,82.14 v74.18,81.44 | v42.19,78.51 40.51,76.83 35.76,76.83 34.92,76 34.92,75.86 34.37,75.3 34.37,75.02 B1.D6
NOSE_R  (via drill 0.2)
  Top 0.305: J11.3 42.47,90.11 42.47,89.27 42.33,89.13 42.33,88.85 41.91,88.43 41.91,85.5 32.41,76 32.41,75.86 31.85,75.3 31.85,75.02 B1.D7 31.71,74.88 31.71,74.6 24.87,67.75 v24.87,66.36 | v63.56,20.4 63.56,8.94 J9.1
  Bottom 0.305: v63.56,20.4 63.56,27.66 v24.87,66.36
V_VALVE  (via drill 0.35)
  Top 0.61: U1.10 87.73,40.65 94.58,40.65 98.35,36.88 99.05,36.88 J18.1 | J7.1 125.73,85.09 v125.73,80.01 | v137.16,76.2 JP1.2
  Bottom 0.61: J15.1 23.33,93.18 67.2,93.18 68.66,91.71 | 68.66,91.71 69.43,90.94 69.43,90.81 69.85,90.39 J5.1 69.99,89.97 69.99,89.41 70.27,89.13 70.27,88.99 71.25,88.01 71.25,57.84 86.33,42.75 86.33,42.19 87.59,40.93 87.59,40.65 U1.10 | 68.66,91.71 69.15,92.2 119.16,92.2 120.56,90.81 120.56,90.25 J7.1 | v125.73,80.01 133.35,80.01 v137.16,76.2
VALVE_C  (via drill 0.2)
  Top 0.305: 64.89,24.94 51.87,11.91 48.51,11.91 45.54,8.94 45.12,8.94 J8.3 | 64.89,24.94 72.36,32.41 72.36,32.97 U1.3 | 64.89,24.94 v62.73,27.1
  Bottom 0.305: v62.73,27.1 15.37,74.46 15.37,74.88 B1.D13
VALVE_C_POWER
  Bottom 0.61: U1.16 72.36,40.65 72.36,41.49 70.27,43.59 70.27,86.75 67.33,89.69 67.33,90.11 J5.2
VALVE_L  (via drill 0.2)
  Top 0.305: 65.24,33.11 59.63,33.11 36.77,10.25 34.28,10.25 31.01,6.99 21.93,6.99 20.12,8.8 19.84,8.8 J16.3 | 65.24,33.11 67.2,33.11 U1.1 | 65.24,33.11 v65.24,39.95
  Bottom 0.305: B1.D3 41.91,74.6 65.24,51.27 v65.24,39.95
VALVE_L_POWER  (via drill 0.2)
  Top 0.61: v81.44,53.78 79.63,53.78 67.33,41.49 67.33,40.65 U1.18 | J7.2 v115.11,87.17
  Bottom 0.61: v81.44,53.78 114.83,87.17 v115.11,87.17
VALVE_R  (via drill 0.2)
  Top 0.305: U1.5 77.39,32.97 77.39,32.55 71.67,26.82 71.67,10.34 70.55,9.22 70.55,8.94 J9.3 | v38.84,63.84 38.84,73.34 39.26,73.76 39.26,74.88 B1.D4
  Bottom 0.305: v38.84,63.84 67.47,35.2 75.86,35.2 77.39,33.67 77.39,33.11 U1.5
VALVE_R_POWER
  Bottom 0.61: U1.14 77.39,40.51 77.39,40.09 75.72,38.42 65.52,38.42 29.9,74.04 29.9,77.67 17.88,89.69 17.88,90.11 J15.2
VIN
  Top 0.61: JP1.1 148.64,69.85 151.44,72.64 151.71,72.64 152.69,73.62 153.81,73.62 J14.PWR

### Text on the board
tPlace: + - | Black | Green | Blue | Red | White | + - | Black | Green | Blue | Red | White | + - | Black | Green | Blue | Red | White | GND | Sig | 5V | GND | Sig | 5V | GND | Sig | 5V | LED | Valve | Lick | Nose | LED | Valve | Lick | Nose | LED | Valve | Lick | Nose | Right | Center | Left | J30 | J31 | R | C | L | V_in | 5V / V_valve / V_in | Two Armed Bandit PCB | HMS Research Instrumentation Core / v 1.1; OM; 10/2020 | Photinterrupter / 160 Ω | LED | R | C | L | Lick RC Filters / (optional) | Laser | ULN2803A | Aux | 5V | 5V | J33 | J32 | Aux1/Laser | Aux 2 | Aux 3 | To DAQ | Aux 4 | GND | Left | Center | Right | Aux | GND | *A1 = Laser | Nose | Lick | Valve | LED | GND | GND | Nose | Lick | Valve | LED | GND | GND | Nose | Lick | Valve | LED | GND | GND | A1* | A2 | A3 | A4 | GND | GND